# Altium schematic sheet Output terminals.SchDoc
size A4
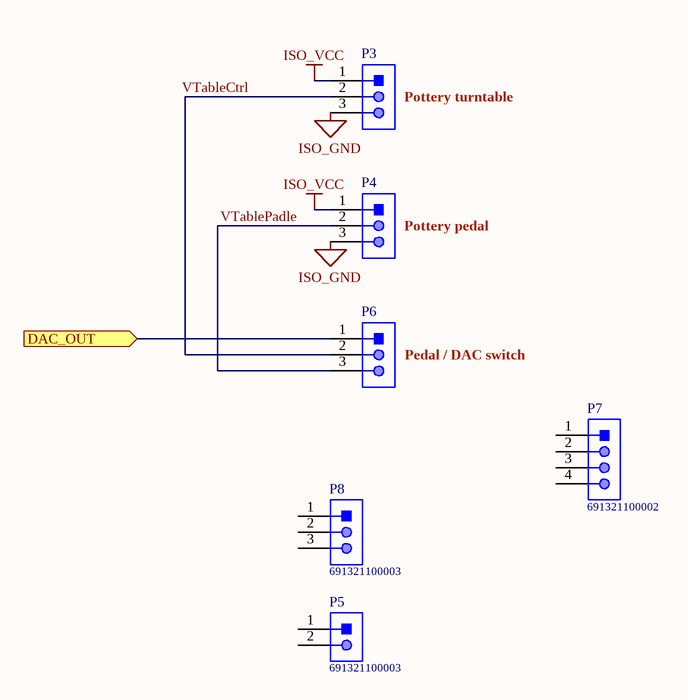
[diagram p0: Output terminals.SchDoc]

## Parts
P3  691321100003  [691321100003]  (value not drawn)
P4  691321100002  [691321100003]  (value not drawn)
P5  691321100003  [691321100002]
P6  691321100002  [691321100003]  (value not drawn)
P7  691321100002  [691321100004]
P8  691321100003  [691321100003]

## Ports
DAC_OUT (in)

## Nets
ISO_GND: P3.3 P4.3
ISO_VCC: P3.1 P4.1
DAC_OUT: P6.1 ; port DAC_OUT
VTableCtrl: P3.2 P6.2
VTablePadle: P4.2 P6.3

Not connected (* = marked no-connect by the designer): P5 1 2; P7 1 2 3 4; P8 1 2 3

## Notes on the sheet
- (near P3) Pottery turntable
- (near P4) Pottery pedal
- (near P6) Pedal / DAC switch

## Library data of the parts
P3 P4 P6 P8 = CMP-1502-01784-1: Serie 3211 - 3.50mm Vertical PCB Header WR-TBL, 3 pin; Manufacturer: Wurth Elektronik; Pin Number: 3; Gender: Male; Datasheet URL: http://katalog.we-online.de/em/datasheet/6913211000xx.pdf; Package Reference: 691321100003; Pitch: 3.50mm; Publisher: WurthElektronik; Part Number: 691321100003; Mounting Technology: THT; Packaging: Box; Manufacturer URL: http://www.we-online.de; Operating Temperature: -40to105degC
P5 = CMP-1502-01783-1: Serie 3211 - 3.50mm Vertical PCB Header WR-TBL, 2 pin; Manufacturer: Wurth Elektronik; Gender: Male; Pin Number: 2; Part Number: 691321100002; Mounting Technology: THT; Manufacturer URL: http://www.we-online.de; Datasheet URL: http://katalog.we-online.de/em/datasheet/6913211000xx.pdf; Packaging: Box; Package Reference: 691321100002; Publisher: WurthElektronik; Pitch: 3.50mm; Operating Temperature: -40to105degC
P7 = CMP-1502-01785-1: Serie 3211 - 3.50mm Vertical PCB Header WR-TBL, 4 pin; Manufacturer: Wurth Elektronik; Gender: Male; Pin Number: 4; Operating Temperature: -40to105degC; Packaging: Box; Package Reference: 691321100004; Part Number: 691321100004; Mounting Technology: THT; Pitch: 3.50mm; Publisher: WurthElektronik; Manufacturer URL: http://www.we-online.de; Datasheet URL: http://katalog.we-online.de/em/datasheet/6913211000xx.pdf